# Altium project Quadruped.PrjPcb
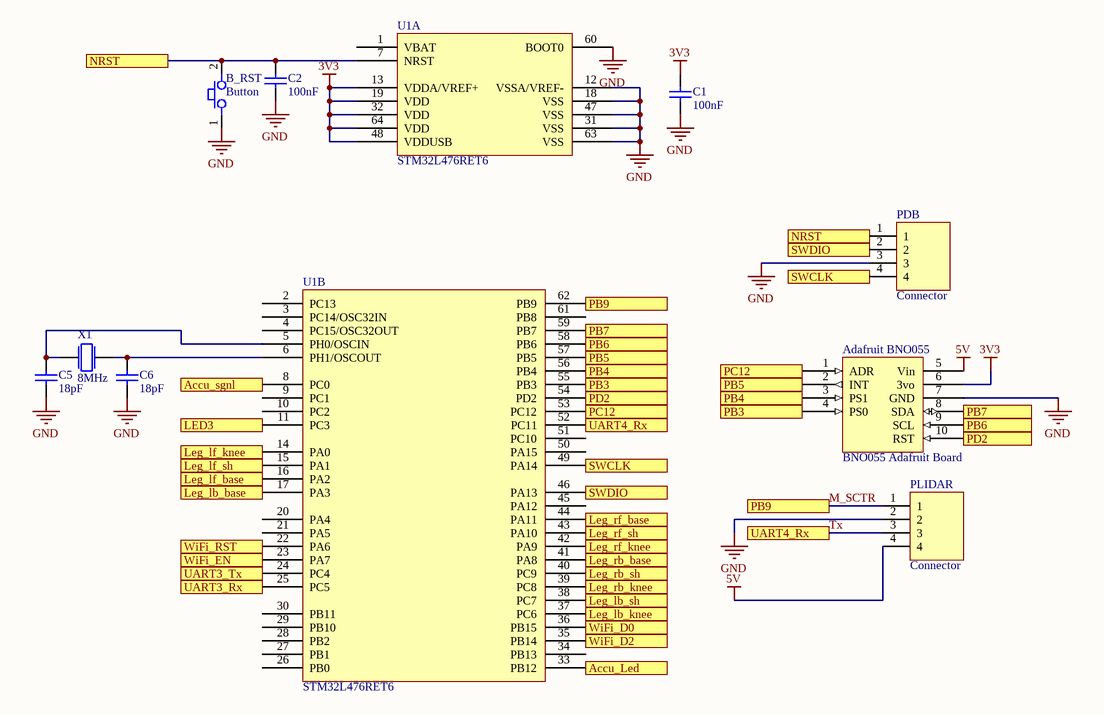
[diagram p0: mcu.SchDoc]
4 sheets, 47 parts. Net scope: flat (ports and power ports of the same name join across sheets).
Board file: pcb.PcbDoc
Sheets:
  mcu.SchDoc
  power.SchDoc
  motor.SchDoc
  wifi_sensor.SchDoc

## Sheet mcu.SchDoc
size A4

### Parts
Adafruit_BNO055  BNO055 Adafruit Board  [ADAFRUIT BNO055]
B_RST  Button  [Button]
C1  100nF  [FP_0805_CAP_085]
C2  100nF  [FP_0805_CAP_085]
C5  18pF  [FP_0805_CAP_085]
C6  18pF  [FP_0805_CAP_085]
PDB  Connector  [FP_CONN4_TAP_254MM_90]
PLIDAR  Connector  [FP_CONN4_LIDAR_2MM_90]
U1  STM32L476RET6  [STM32L476RET6]  (parts A,B of 2)
X1  8MHz  [OSC]

### Ports
Accu_Led, Accu_sgnl, LED3, Leg_lb_base, Leg_lb_knee, Leg_lb_sh, Leg_lf_base, Leg_lf_knee, Leg_lf_sh, Leg_rb_base, Leg_rb_knee, Leg_rb_sh, Leg_rf_base, Leg_rf_knee, Leg_rf_sh, NRST, PB3, PB4, PB5, PB6, PB7, PB9, PC12, PD2, SWCLK, SWDIO, UART3_Rx, UART3_Tx, UART4_Rx, WiFi_D0, WiFi_D2, WiFi_EN, WiFi_RST

### Nets
3V3: Adafruit_BNO055.6(3vo) C1.2 U1.13(VDDA/VREF+) U1.19(VDD) U1.32(VDD) U1.48(VDDUSB) U1.64(VDD)
5V: Adafruit_BNO055.5(Vin) PLIDAR.4
GND: Adafruit_BNO055.7(GND) B_RST.1 C1.1 C2.1 C5.1 C6.1 PDB.3 PLIDAR.2 U1.12(VSSA/VREF-) U1.18(VSS) U1.31(VSS) U1.47(VSS) U1.60(BOOT0) U1.63(VSS)
M_SCTR: PLIDAR.1 U1.62(PB9) ; port PB9
Tx: PLIDAR.3 U1.52(PC11) ; port UART4_Rx
NetAdafruit_BNO055_1: Adafruit_BNO055.1(ADR) U1.53(PC12) ; port PC12
NetAdafruit_BNO055_2: Adafruit_BNO055.2(INT) U1.57(PB5) ; port PB5
NetAdafruit_BNO055_3: Adafruit_BNO055.3(PS1) U1.56(PB4) ; port PB4
NetAdafruit_BNO055_4: Adafruit_BNO055.4(PS0) U1.55(PB3) ; port PB3
NetAdafruit_BNO055_8: Adafruit_BNO055.8(SDA) U1.59(PB7) ; port PB7
NetAdafruit_BNO055_9: Adafruit_BNO055.9(SCL) U1.58(PB6) ; port PB6
NetAdafruit_BNO055_10: Adafruit_BNO055.10(RST) U1.54(PD2) ; port PD2
NetB_RST_2: B_RST.2 C2.2 PDB.1 U1.7(NRST) ; port NRST
NetC5_2: C5.2 U1.5(PH0/OSCIN) X1.1
NetC6_2: C6.2 U1.6(PH1/OSCOUT) X1.2
NetP_lb_b_1: U1.17(PA3) ; port Leg_lb_base
NetP_lb_k_1: U1.37(PC6) ; port Leg_lb_knee
NetP_lb_s_1: U1.38(PC7) ; port Leg_lb_sh
NetP_lf_b_1: U1.16(PA2) ; port Leg_lf_base
NetP_lf_k_1: U1.14(PA0) ; port Leg_lf_knee
NetP_lf_s_1: U1.15(PA1) ; port Leg_lf_sh
NetP_rb_b_1: U1.41(PA8) ; port Leg_rb_base
NetP_rb_k_1: U1.39(PC8) ; port Leg_rb_knee
NetP_rb_s_1: U1.40(PC9) ; port Leg_rb_sh
NetP_rf_b_1: U1.44(PA11) ; port Leg_rf_base
NetP_rf_k_1: U1.42(PA9) ; port Leg_rf_knee
NetP_rf_s_1: U1.43(PA10) ; port Leg_rf_sh
NetPDB_2: PDB.2 U1.46(PA13) ; port SWDIO
NetPDB_4: PDB.4 U1.49(PA14) ; port SWCLK
NetR3_1: U1.8(PC0) ; port Accu_sgnl
NetR6_2: U1.33(PB12) ; port Accu_Led
NetR9_2: U1.11(PC3) ; port LED3
NetR10_2: U1.35(PB14) ; port WiFi_D2
NetR11_2: U1.36(PB15) ; port WiFi_D0
NetU1_22: U1.22(PA6) ; port WiFi_RST
NetU1_23: U1.23(PA7) ; port WiFi_EN
NetU1_24: U1.24(PC4) ; port UART3_Tx
NetU1_25: U1.25(PC5) ; port UART3_Rx

Not connected (* = marked no-connect by the designer): U1 1(VBAT) 2(PC13) 3(PC14/OSC32IN) 4(PC15/OSC32OUT) 9(PC1) 10(PC2) 20(PA4) 21(PA5) 26(PB0) 27(PB1) 28(PB2) 29(PB10) 30(PB11) 34(PB13) 45(PA12) 50(PA15) 51(PC10) 61(PB8)

### Library data of the parts
Adafruit_BNO055 = BNO055 Adafruit Board: pin to pad: 1>ADR 2>INT 3>PS1 4>PS0 5>Vin 6>3vo 7>GND 8>SDA 9>SCL 10>RST; Reference: 485-2472; Name: Adafruit BNO055; Supplier: Mouser Electronics
B_RST = Button: Name: TACT 2.5x 3 2P SPST B3U-1000P (OMR) 2.5x3x1.2mm SMD H=1.2mm 153g; Reference: 45-09-96; Supplier: Lomex
C1 C2 = CAP 100nF: Capacitor; Tolerance: 10%; Voltage: 50V; Name: 100nF 0805 10% 50V X7R 0805B104K500CT (WAL); Supplier: Lomex; Reference: 82-10-76; Value: 100nF
C5 C6 = CAP: Capacitor; Tolerance: 5%; Voltage: 50V; Name: 18pF 0805 5% 50V NP0 CL21C180JBANNNC (SAM); Supplier: Lomex; Reference: 82-08-38; Value: 18pF
PDB = Connector_4pin: 4pin Connector; Name: TÁPCSATL. 2.54mm 4P APA 90° NCW254-04R (G-S) FORR.; Reference: 43-09-96; Supplier: Lomex
PLIDAR = Connector_4pin: 4pin Connector; Name: TÁPCSATL. 2.00mm 4P APA 90° B4B-PH-SM4-TB (LF)(SN) (JST) SMD Ł; Reference: 43-17-55; Supplier: Lomex
U1 = STM32L476RET6: Manufacturer: STMICROELECTRONICS; Reference: 2494459; Name: STM32L476RET6 -  ARM Microcontroller, Ultra Low Power, STM32 Family STM32L4 Series Microcontrollers, 32bit, 80 MHz; Manufacturer Part No: STM32L476RET6; Component Type: IC; Supplier: Farnell
X1 = Crystal: Quarz Crystal; Reference: 2508478; Name: QCS8.00000F18B23M -  Crystal, 8 MHz, SMD, 12.5mm x 4.6mm, 30 ppm, 18 pF, 20 ppm, QCS Series; Value: 8MHz; Supplier: Farnell

## Sheet power.SchDoc
size A4
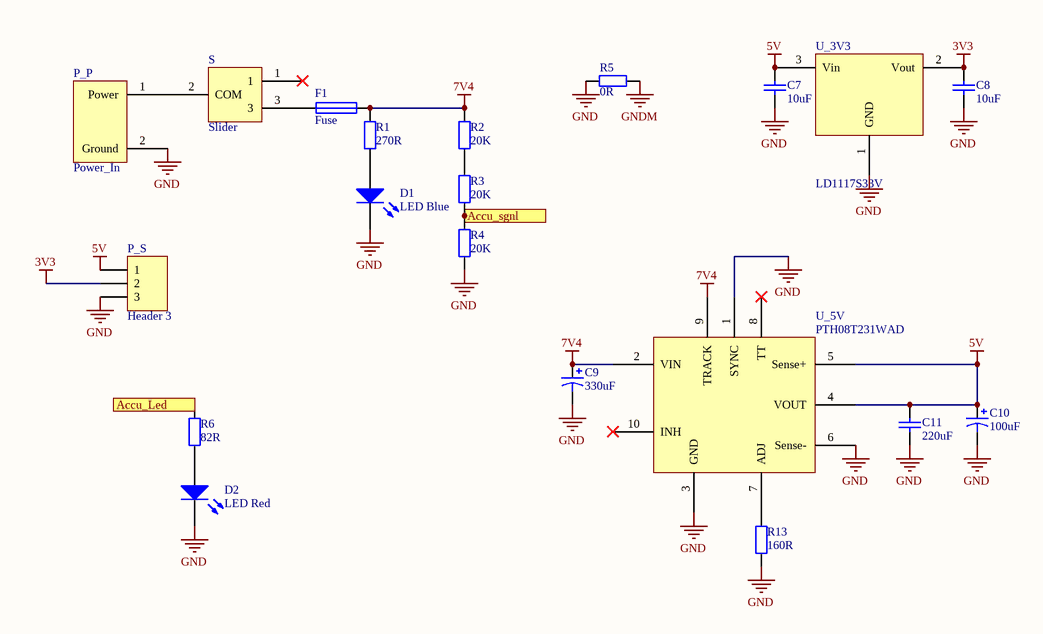
[diagram p1: power.SchDoc]

### Parts
C7  10uF  [FP_0805_CAP_085]
C8  10uF  [FP_0805_CAP_085]
C9  330uF  [FP_7343]
C10  100uF  [FP_3528]
C11  220uF  [FP_1206_CAP_125]
D1  LED Blue  [FP_0805_LED_RED]
D2  LED Red  [FP_0805_LED_RED]
F1  Fuse  [MULTIFUSE]
P_P  Power_In  [SORK.3.81mm]
P_S  Header 3  [HDR1X3]
R1  270R  [FP_0805_RES]
R2  20K  [FP_0805_RES]
R3  20K  [FP_0805_RES]
R4  20K  [FP_0805_RES]
R5  0R  [FP_0805_RES]
R6  82R  [FP_0805_RES]
R13  160R  [FP_0805_RES]
S  Slider  [Slide]
U_3V3  LD1117S33V  [FP_SOT223]
U_5V  PTH08T231WAD  [5V SUPPLY]

### Ports
Accu_Led, Accu_sgnl

### Nets
3V3: C8.2 P_S.2 U_3V3.2(Vout)
5V: C7.2 C10.P C11.2 P_S.1 U_3V3.3(Vin) U_5V.4(VOUT) U_5V.5(Sense+)
7V4: C9.P F1.2 R1.2 R2.2 U_5V.2(VIN) U_5V.9(TRACK)
GND: C7.1 C8.1 C9.N C10.N C11.1 D1.2(K) D2.2(K) P_P.2(Ground) P_S.3 R4.1 R5.1 R13.1 U_3V3.1(GND) U_5V.1(SYNC) U_5V.3(GND) U_5V.6(Sense-)
GNDM: R5.2
NetD1_1: D1.1(A) R1.1
NetD2_1: D2.1(A) R6.1
NetF1_1: F1.1 S.3
NetP_P_1: P_P.1(Power) S.2(COM)
NetR2_1: R2.1 R3.2
NetR3_1: R3.1 R4.2 ; port Accu_sgnl
NetR6_2: R6.2 ; port Accu_Led
NetR13_2: R13.2 U_5V.7(ADJ)

Not connected (* = marked no-connect by the designer): S 1*; U_5V 8(TT)* 10(INH)*

### Library data of the parts
C7 C8 = CAP 10uF: Capacitor; Tolerance: 10%; Voltage: 16V; Reference: 2320856; Name: SMD Multilayer Ceramic Capacitor, 0805; Supplier: Farnell; Value: 10uF
C9 = CAP_ELECT: Polarized Capacitor; Voltage: 10V; Tolerance: 20%; Reference: 2762172; Name: T491D337M010AT -  Surface Mount Tantalum Capacitor, 330 µF, 10 V, T491 Series, ± 20%, 2917 [7343 Metric]; Supplier: Farnell; Value: 330uF
C10 = CAP_ELECT: Polarized Capacitor; Voltage: 6.3V; Tolerance: 10%; Name: 100uF ˝B˝ 6.3V 10% TAJB107K006RNJ (AVX) 3528; Supplier: Lomex; Reference: 92-01-45; Value: 100uF
C11 = CAP: Capacitor; Tolerance: 20%; Voltage: 6.3V; Reference: 2671588; Name: GRM32ER60J227ME05L -  SMD Multilayer Ceramic Capacitor, 1210 [3225 Metric], 220 µF, 6.3 V, ± 20%, X5R, GRM Series; Supplier: Farnell; Value: 220uF
D1 = LED Blue: Blue LED; pin to pad: 1>A 2>K; U_fw: 3.3V; I_max: 25mA; Name: 2012 BLUE 465nm 170mcd FYLS-0805UBC (FYL) W.CLEAR 2.0x1.2x0.8mm 0805 130°; Wavelength: 465nm; Supplier: Lomex; Reference: 95-01-58
D2 = LED Red: Red LED; pin to pad: 1>A 2>K; U_fw: 1.9V; I_max: 30mA; Name: 2012 RED 643nm 28mcd FYLS-0805HRC (FYL) W.CLEAR 2.0x1.2x0.8mm 0805 130°; Wavelength: 643nm; Supplier: Lomex; Reference: 95-00-19
F1 = Fuse: Name: Lomex; Reference: 44-03-11; Supplier: Lomex
P_P = Power_In: Name: SORKAPOCS 2 P RM3.81 CSAPSORLÉC 90° TLPHC100R-02P (TLM) ZÁRT 10A 150V VDE; Supplier: Lomex; Reference: 43-27-99
P_S = Header 3: Header, 3-Pin; LatestRevisionDate: 17-Jul-2002; LatestRevisionNote: Re-released for DXP Platform.; Publisher: Altium Limited
R1 = RES 270R: Resistor; Tolerance: 5%; Power: 125mW; Name: YAGEO (PHYCOMP)  RC0805JR-07270RL  SMD Chip Resistor, Thick Film, 270 ohm; Reference: 9233938; Supplier: Farnell; Value: 270R
R2-R4 = RES: Resistor; Tolerance: 1%; Power: 0.125W; Name: 20K0 0805 1% CR-05FL7---20K 0.125W (VIK); Supplier: Lomex; Reference: 80-11-47; Value: 20K
R5 = RES: Resistor; Power: 0.125W; Name: 0R00 0805 CR-05JL7----0R 0.125W (VIK) Iav=2A; Supplier: Lomex; Reference: 81-10-02; Value: 0R
R6 = RES 82R: Resistor; Tolerance: 5%; Power: 125mW; Name: MULTICOMP  MCMR08X820 JTL  SMD Chip Resistor, Ceramic, 82 ohm; Reference: 2073848; Supplier: Farnell; Value: 82R
R13 = RES: Resistor; Tolerance: 1%; Power: 0.125W; Name: 160R 0805 1% RC0805FR-07160RL 0.125W (YAG); Supplier: Lomex; Reference: 80-01-97; Value: 160R
S = Slider: Name: Kapcsoló: csúszó; Pozíció:2; SPDT; 2A/250VAC; 5A/28VDC; ON-ON; Reference: 5MS1S102AM2QE; Supplier: TME
U_3V3 = LD1117S33V: Name: TS1117BCW-3.3 -  Fixed LDO Voltage Regulator, 0V to 12V, 1.3V Dropout, 3.3Vout, 800mAout, SOT-223-3; Reference: 7208359; Supplier: Farnell
U_5V = 5V_SUPPLY: Reference: 2383162; Name: PTH08T231WAD -  Non Isolated POL DC/DC Converter, 1 Output, 33 W, 5.5 V, 6 A, Adjustable, Through Hole; Supplier: Farnell

## Sheet motor.SchDoc
size A4
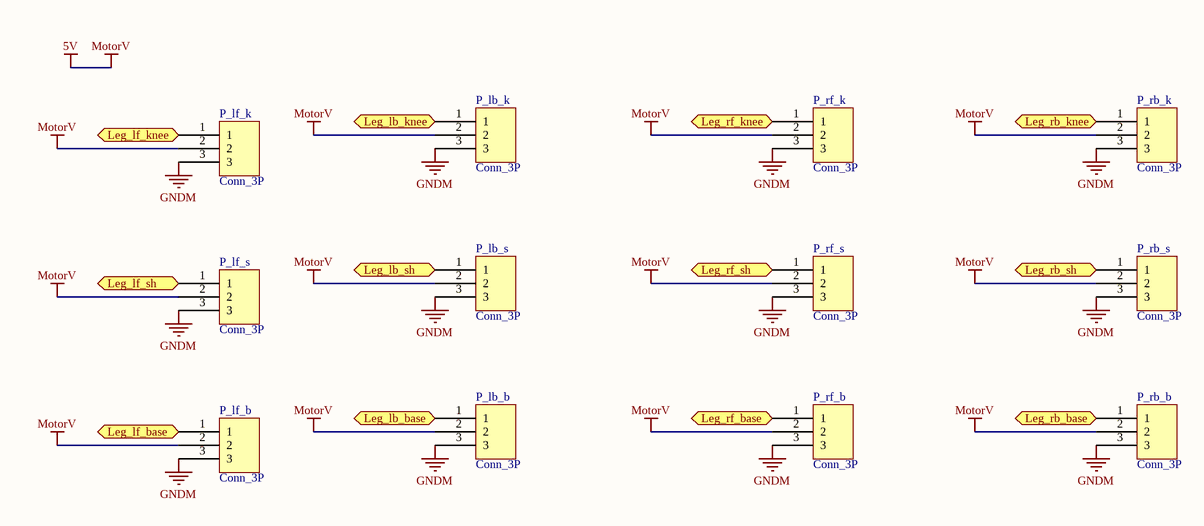
[diagram p2: motor.SchDoc]

### Parts
P_lb_b  Conn_3P  [3P_CONN_2mm]
P_lb_k  Conn_3P  [3P_CONN_2mm]
P_lb_s  Conn_3P  [3P_CONN_2mm]
P_lf_b  Conn_3P  [3P_CONN_2mm]
P_lf_k  Conn_3P  [3P_CONN_2mm]
P_lf_s  Conn_3P  [3P_CONN_2mm]
P_rb_b  Conn_3P  [3P_CONN_2mm]
P_rb_k  Conn_3P  [3P_CONN_2mm]
P_rb_s  Conn_3P  [3P_CONN_2mm]
P_rf_b  Conn_3P  [3P_CONN_2mm]
P_rf_k  Conn_3P  [3P_CONN_2mm]
P_rf_s  Conn_3P  [3P_CONN_2mm]

### Ports
Leg_lb_base, Leg_lb_knee, Leg_lb_sh, Leg_lf_base, Leg_lf_knee, Leg_lf_sh, Leg_rb_base, Leg_rb_knee, Leg_rb_sh, Leg_rf_base, Leg_rf_knee, Leg_rf_sh

### Nets
5V: P_lb_b.2 P_lb_k.2 P_lb_s.2 P_lf_b.2 P_lf_k.2 P_lf_s.2 P_rb_b.2 P_rb_k.2 P_rb_s.2 P_rf_b.2 P_rf_k.2 P_rf_s.2  [also labelled MotorV]
GNDM: P_lb_b.3 P_lb_k.3 P_lb_s.3 P_lf_b.3 P_lf_k.3 P_lf_s.3 P_rb_b.3 P_rb_k.3 P_rb_s.3 P_rf_b.3 P_rf_k.3 P_rf_s.3
NetP_lb_b_1: P_lb_b.1 ; port Leg_lb_base
NetP_lb_k_1: P_lb_k.1 ; port Leg_lb_knee
NetP_lb_s_1: P_lb_s.1 ; port Leg_lb_sh
NetP_lf_b_1: P_lf_b.1 ; port Leg_lf_base
NetP_lf_k_1: P_lf_k.1 ; port Leg_lf_knee
NetP_lf_s_1: P_lf_s.1 ; port Leg_lf_sh
NetP_rb_b_1: P_rb_b.1 ; port Leg_rb_base
NetP_rb_k_1: P_rb_k.1 ; port Leg_rb_knee
NetP_rb_s_1: P_rb_s.1 ; port Leg_rb_sh
NetP_rf_b_1: P_rf_b.1 ; port Leg_rf_base
NetP_rf_k_1: P_rf_k.1 ; port Leg_rf_knee
NetP_rf_s_1: P_rf_s.1 ; port Leg_rf_sh

### Library data of the parts
P_lb_b P_lb_k P_lb_s P_lf_b P_lf_k P_lf_s P_rb_b P_rb_k P_rb_s P_rf_b P_rf_k P_rf_s = Conn_3P: Name: TÁPCSATL. 2.00mm 3P APA 180° NCW200-03S (G-S) FORR.; Supplier: Lomex; Reference: 43-16-04

## Sheet wifi_sensor.SchDoc
size A4
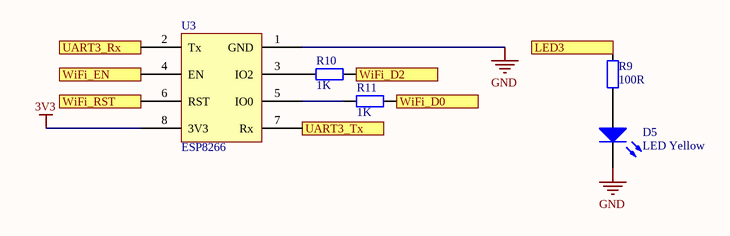
[diagram p3: wifi_sensor.SchDoc]

### Parts
D5  LED Yellow  [FP_0805_LED_RED]
R9  100R  [FP_0805_RES]
R10  1K  [FP_0805_RES]
R11  1K  [FP_0805_RES]
U3  ESP8266  [HDR2X4]

### Ports
LED3, UART3_Rx, UART3_Tx, WiFi_D0, WiFi_D2, WiFi_EN, WiFi_RST

### Nets
3V3: U3.8(3V3)
GND: D5.2(K) U3.1(GND)
NetD5_1: D5.1(A) R9.1
NetR9_2: R9.2 ; port LED3
NetR10_1: R10.1 U3.3(IO2)
NetR10_2: R10.2 ; port WiFi_D2
NetR11_1: R11.1 U3.5(IO0)
NetR11_2: R11.2 ; port WiFi_D0
NetU1_22: U3.6(RST) ; port WiFi_RST
NetU1_23: U3.4(EN) ; port WiFi_EN
NetU1_24: U3.7(Rx) ; port UART3_Tx
NetU1_25: U3.2(Tx) ; port UART3_Rx

### Library data of the parts
D5 = LED Yellow: Yellow LED; pin to pad: 1>A 2>K; U_fw: 2.1V; I_max: 20mA; Name: 2012 YELLOW 590nm 220mcd 0805UYC (FEM) 20mA W.CLEAR 2.0x1.2x0.68mm 0805 140°; Wavelength: 590nm; Supplier: Lomex; Reference: 95-03-84
R9 = RES 100R: Resistor; Tolerance: 5%; Power: 125mW; Name: YAGEO (PHYCOMP)  RC0805JR-07100RL  SMD Chip Resistor, Thick Film, 100 ohm,; Reference: 9233881; Supplier: Farnell; Value: 100R
R10 R11 = RES 1K: Resistor; Tolerance: 5%; Power: 125mW; Name: YAGEO (PHYCOMP)  RC0805JR-071KL  SMD Chip Resistor, Thick Film, 1 kohm; Reference: 9234004; Supplier: Farnell; Value: 1K

## Nets that join several sheets
3V3: mcu (7 pins), power (C8.2 P_S.2 U_3V3.2), wifi_sensor (U3.8)
5V: mcu (Adafruit_BNO055.5 PLIDAR.4), power (7 pins), motor (12 pins)
GND: mcu (14 pins), power (16 pins), wifi_sensor (D5.2 U3.1)
GNDM: power (R5.2), motor (12 pins)
NetP_lb_b_1: mcu (U1.17), motor (P_lb_b.1)
NetP_lb_k_1: mcu (U1.37), motor (P_lb_k.1)
NetP_lb_s_1: mcu (U1.38), motor (P_lb_s.1)
NetP_lf_b_1: mcu (U1.16), motor (P_lf_b.1)
NetP_lf_k_1: mcu (U1.14), motor (P_lf_k.1)
NetP_lf_s_1: mcu (U1.15), motor (P_lf_s.1)
NetP_rb_b_1: mcu (U1.41), motor (P_rb_b.1)
NetP_rb_k_1: mcu (U1.39), motor (P_rb_k.1)
NetP_rb_s_1: mcu (U1.40), motor (P_rb_s.1)
NetP_rf_b_1: mcu (U1.44), motor (P_rf_b.1)
NetP_rf_k_1: mcu (U1.42), motor (P_rf_k.1)
NetP_rf_s_1: mcu (U1.43), motor (P_rf_s.1)
NetR3_1: mcu (U1.8), power (R3.1 R4.2)
NetR6_2: mcu (U1.33), power (R6.2)
NetR9_2: mcu (U1.11), wifi_sensor (R9.2)
NetR10_2: mcu (U1.35), wifi_sensor (R10.2)
NetR11_2: mcu (U1.36), wifi_sensor (R11.2)
NetU1_22: mcu (U1.22), wifi_sensor (U3.6)
NetU1_23: mcu (U1.23), wifi_sensor (U3.4)
NetU1_24: mcu (U1.24), wifi_sensor (U3.7)
NetU1_25: mcu (U1.25), wifi_sensor (U3.2)